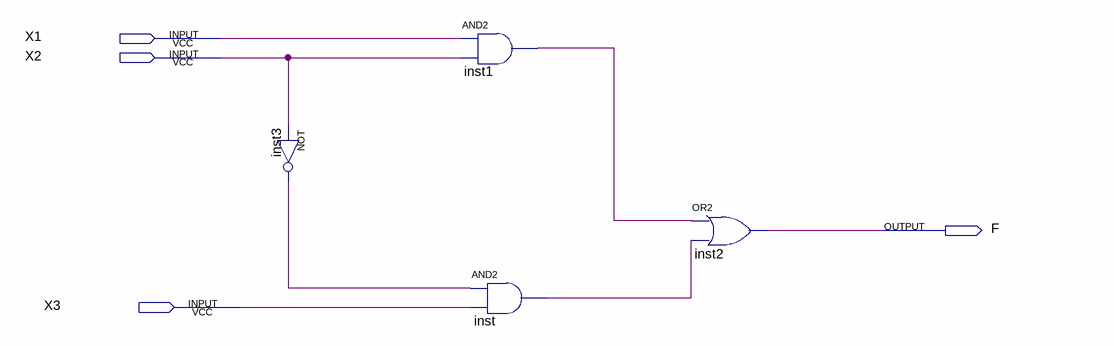
[diagram p0: schematic sheet]
// Quartus schematic lab1.bdf as structural Verilog: 4 symbols, 4 pins
module lab1 (
  input  X1,
  input  X2,
  input  X3,
  output F
);

  wire inst1_out, inst3_out, inst_out;

  not inst3 (inst3_out, X2);
  and inst1 (inst1_out, X1, X2);
  and inst (inst_out, inst3_out, X3);
  or inst2 (F, inst1_out, inst_out);
endmodule
